# EAGLE schematic Elektroskate Teensy 08.08.2014 (EAGLE 7.1.0)
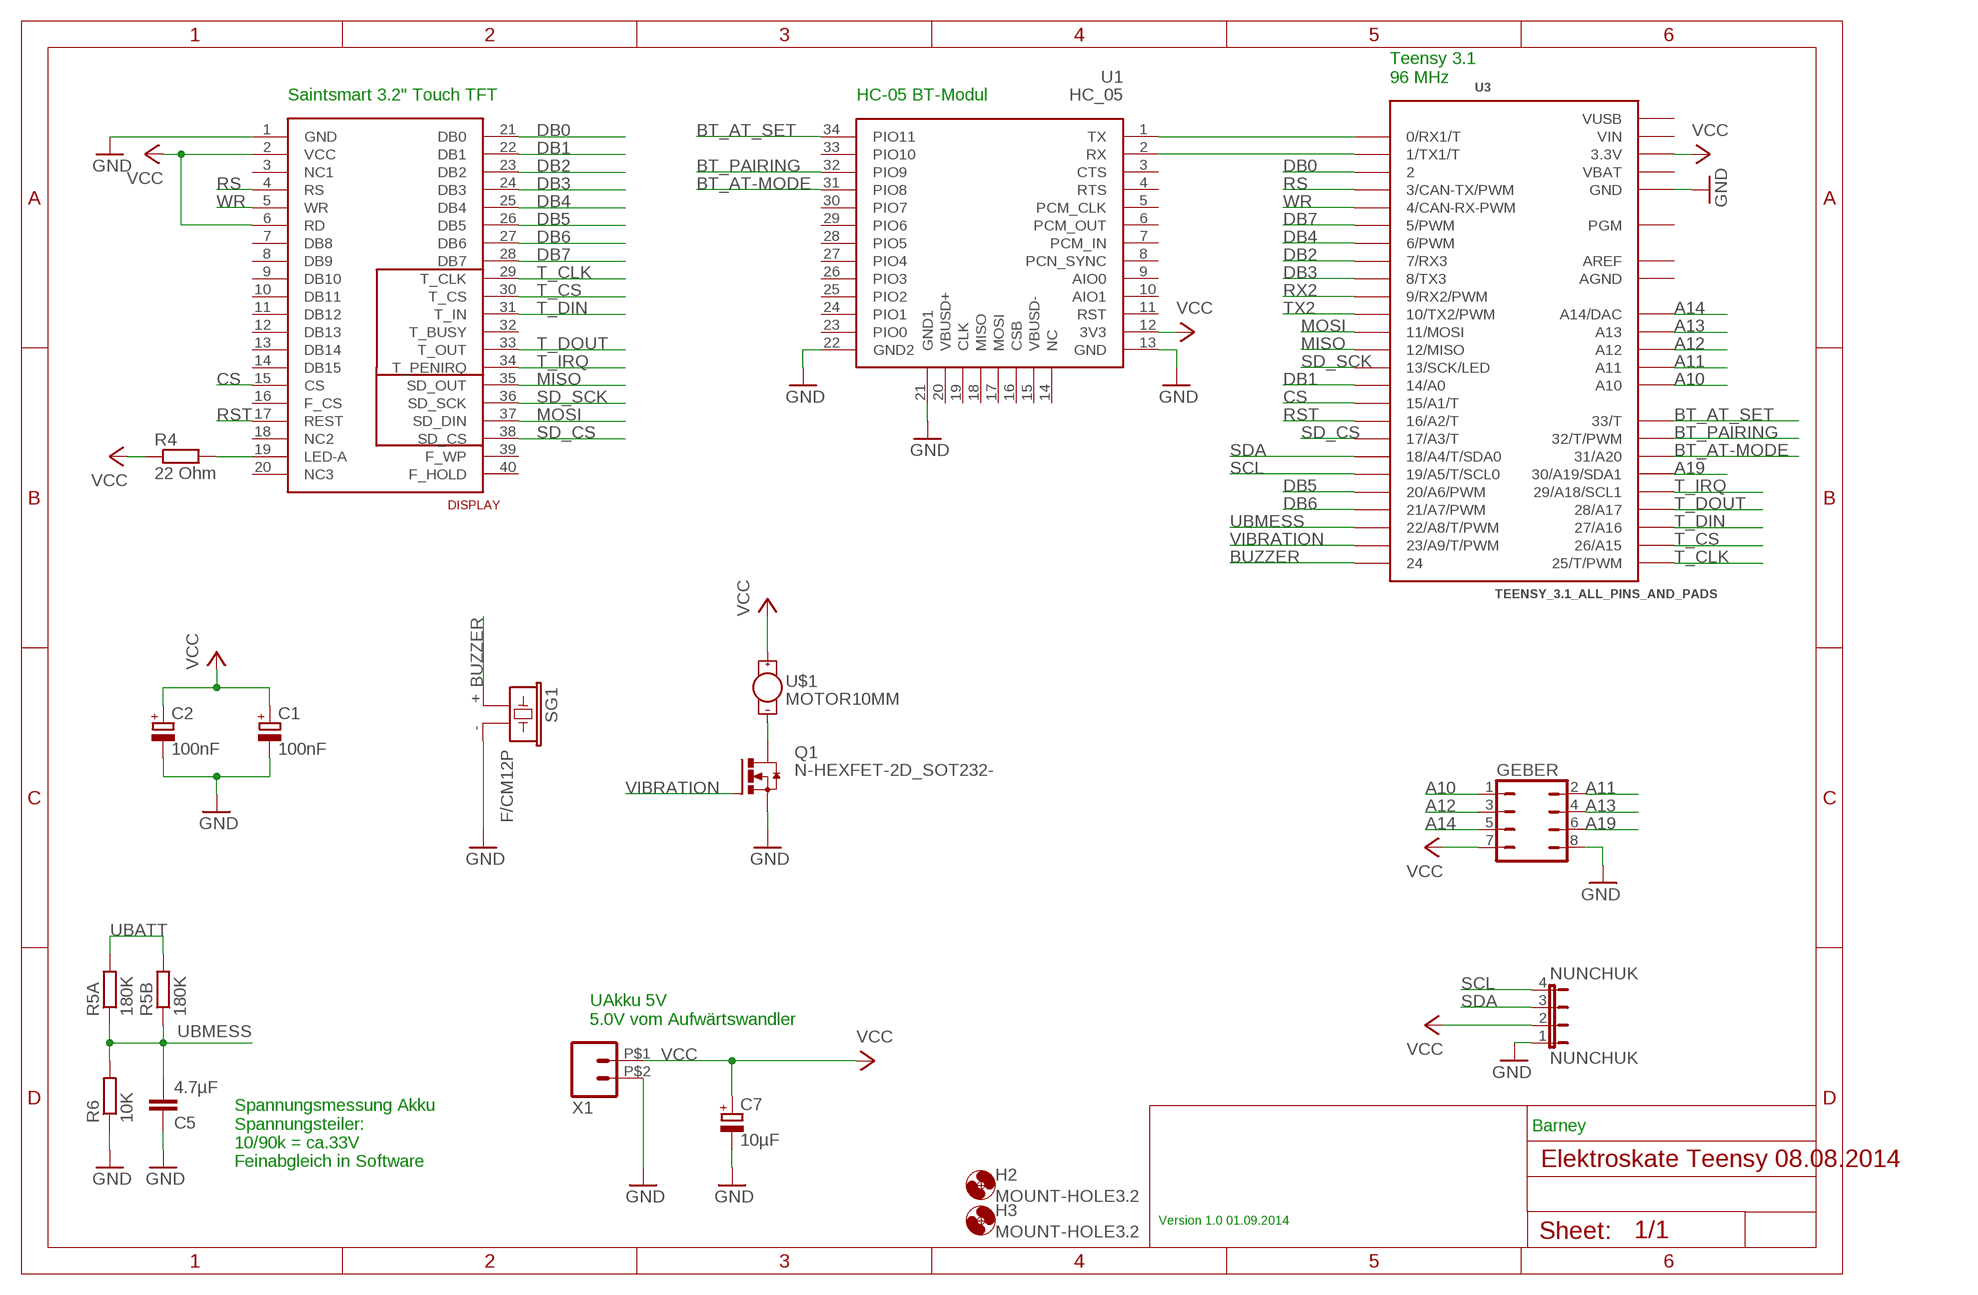
[diagram p0: schematic, sheet 1]

## Parts
C1  100nF  CPOL-EUB45181A  [B45181A]
C2  100nF  CPOL-EUB45181A  [B45181A]
C5  4.7µF  C-EU025-024X044  [C025-024X044]
C7  10µF  CPOL-EUE2-4  [E2-4]
DISPLAY  SAINSMART_3.2INCH_TFT_TOUCH_SDPCB  [TFT_WITH_PCB]
GEBER  JP4Q  [JP4Q]
H2  MOUNT-HOLE3.2  [3,2]
H3  MOUNT-HOLE3.2  [3,2]
NUNCHUK  NUNCHUK  JP4E  [JP4]
Q1  N-HEXFET-2D_SOT232-  [SOT223]
R4  22 Ohm  R-EU_R0805  [R0805]
R5A  180K  R-EU_R0805  [R0805]
R5B  180K  R-EU_M0805  [M0805]
R6  10K  R-EU_R0805  [R0805]
SG1  F/CM12P  [F/CM12P]
U1  HC_05  [BLUETOOTH_SMD]
U3  TEENSY_3.1_ALL_PINS_AND_PADS  [TEENSY_3.1_ALLPINS]
U$1  MOTOR10MM  [VIBE-MOTOR-10MM]
X1  PSS254_2GEWINKELT  [02W]

## Nets
A10: GEBER.1 U3.A10
A11: GEBER.2 U3.A11
A12: GEBER.3 U3.A12
A13: GEBER.4 U3.A13
A14: GEBER.5 U3.A14(A14/DAC)
A19: GEBER.6 U3.30(30/A19/SDA1)
BT_AT-MODE: U1.31(PIO8)
BT_AT_SET: U1.34(PIO11)
BT_PAIRING: U1.32(PIO9)
BUZZER: SG1.+ U3.24
CS: DISPLAY.15(CS) U3.15/A1(15/A1/T)
DB0: DISPLAY.21(DB0) U3.2
DB1: DISPLAY.22(DB1) U3.14/A0
DB2: DISPLAY.23(DB2) U3.7(7/RX3)
DB3: DISPLAY.24(DB3) U3.8(8/TX3)
DB4: DISPLAY.25(DB4) U3.6(6/PWM)
DB5: DISPLAY.26(DB5) U3.20/A6(20/A6/PWM)
DB6: DISPLAY.27(DB6) U3.21/A7(21/A7/PWM)
DB7: DISPLAY.28(DB7) U3.5(5/PWM)
GND [24mil]: C1.- C2.- C5.1 C7.- DISPLAY.1(GND) GEBER.8 NUNCHUK.1 Q1.3(S) R6.1 SG1.- U1.13(GND) U1.21(GND1) U1.22(GND2) U3.GND U3.GND1(GND) U3.GND2(GND) X1.P$2
MISO: DISPLAY.35(SD_OUT) U3.12(12/MISO)
MOSI: DISPLAY.37(SD_DIN) U3.11(11/MOSI)
N$1: U1.1(TX) U3.0(0/RX1/T)
N$2: U1.2(RX) U3.1(1/TX1/T)
N$3: Q1.2(D) Q1.4(D) U$1.-
N$5: DISPLAY.19(LED-A) R4.2
RS: DISPLAY.4(RS) U3.3(3/CAN-TX/PWM)
RST: DISPLAY.17(REST) U3.16/A2(16/A2/T)
RX2: U3.9(9/RX2/PWM)
SCL: NUNCHUK.4 U3.19/A5(19/A5/T/SCL0)
SD_CS: DISPLAY.38(SD_CS)
SD_SCK: DISPLAY.36(SD_SCK) U3.13(13/SCK/LED)
SDA: NUNCHUK.3 U3.18/A4(18/A4/T/SDA0)
T_CLK: DISPLAY.29(T_CLK)
T_CS: DISPLAY.30(T_CS)
T_DIN: DISPLAY.31(T_IN) U3.27(27/A16)
T_DOUT: DISPLAY.33(T_OUT) U3.28(28/A17)
T_IRQ: DISPLAY.34(T_PENIRQ) U3.29(29/A18/SCL1)
TX2: U3.10(10/TX2/PWM)
UBATT [24mil]: R5A.2 R5B.2
UBMESS: C5.2 R5A.1 R5B.1 R6.2 U3.22/A8(22/A8/T/PWM)
VCC [48mil]: C1.+ C2.+ C7.+ DISPLAY.2(VCC) DISPLAY.6(RD) GEBER.7 NUNCHUK.2 R4.1 U1.12(3V3) U3.3.3V U3.3.3V1(3.3V) U3.3.3V2(3.3V) U$1.+ X1.P$1
VIBRATION: U3.23/A9(23/A9/T/PWM)
WR: DISPLAY.5(WR) U3.4(4/CAN-RX-PWM)
Unconnected: DISPLAY.3(NC1) DISPLAY.7(DB8) DISPLAY.8(DB9) DISPLAY.9(DB10) DISPLAY.10(DB11) DISPLAY.11(DB12) DISPLAY.12(DB13) DISPLAY.13(DB14) DISPLAY.14(DB15) DISPLAY.16(F_CS) DISPLAY.18(NC2) DISPLAY.20(NC3) DISPLAY.32(T_BUSY) DISPLAY.39(F_WP) DISPLAY.40(F_HOLD) Q1.1(G) U1.3(CTS) U1.4(RTS) U1.5(PCM_CLK) U1.6(PCM_OUT) U1.7(PCM_IN) U1.8(PCN_SYNC) U1.9(AIO0) U1.10(AIO1) U1.11(RST) U1.14(NC) U1.15(VBUSD-) U1.16(CSB) U1.17(MOSI) U1.18(MISO) U1.19(CLK) U1.20(VBUSD+) U1.23(PIO0) U1.24(PIO1) U1.25(PIO2) U1.26(PIO3) U1.27(PIO4) U1.28(PIO5) U1.29(PIO6) U1.30(PIO7) U1.33(PIO10) U3.17/A3(17/A3/T) U3.25(25/T/PWM) U3.26(26/A15) U3.31(31/A20) U3.32(32/T/PWM) U3.33(33/T) U3.PGM

## Notes on the sheet
- Teensy 3.1
  96 MHz
- Saintsmart 3.2" Touch TFT | HC-05 BT-Modul
- UAkku 5V
  5.0V vom Aufwärtswandler
- Barney
- Spannungsmessung Akku
  Spannungsteiler:
  10/90k = ca.33V
  Feinabgleich in Software
- Version 1.0 01.09.2014

## Power pins joined to a net without a drawn wire
AGND: U3.AGND
AREF: U3.AREF
VBAT: U3.VBAT
VIN: U3.VIN
VUSB: U3.VUSB

## Library data of the parts
C1 C2 C7 = rcl:CPOL-EU: POLARIZED CAPACITOR, European symbol
C5 = rcl:C-EU: CAPACITOR, European symbol
DISPLAY = Saintsmart 3.2inch TFT Touch:SAINSMART_3.2INCH_TFT_TOUCH_SD
GEBER = jumper:JP4Q: JUMPER
H2 H3 = holes:MOUNT-HOLE: MOUNTING HOLE with drill center marker
NUNCHUK = jumper:JP4E: JUMPER
Q1 = transistor-power:N-HEXFET-2D_?-*: HEXFET® Power MOSFET 2 Drain connects http://www.irf.com/product-info/datasheets/data/irll014n.pdf
R4 R5A R5B R6 = rcl:R-EU_: RESISTOR, European symbol
SG1 = buzzer:F/CM12P: BUZZER Source: Buerklin; OC_FARNELL: unknown; OC_NEWARK: unknown
U1 = Bluetooth HC-05:HC_05: HC-05 Bluetooth Module
U3 = Teensy_3_Series_Board_v1.0:TEENSY_3.1_ALL_PINS_AND_PADS: Footprint for Teensy 3.1 board using all pads and all through-holes. Pads need a 2x7 0.1" SMD header.
U$1 = SparkFun-Electromechanical:MOTOR: Vibration Motor- ROB-08449 Physical dimension and wire connections for this powerful vibration motor. Motor has a self adhesive backing.
X1 = con-pss254_reichelt:PSS254_2

## Net classes
0 default: width 0.305 mm, clearance 0.205 mm
1 24mil: width 0.61 mm, clearance 0.205 mm to class 0, clearance 0.205 mm
2 48mil: width 1.219 mm, clearance 0.205 mm to class 0, clearance 0.205 mm to class 1, clearance 0.205 mm
3 96mil: width 2.438 mm